# EAGLE design ccard_v1 (EAGLE 5.02)
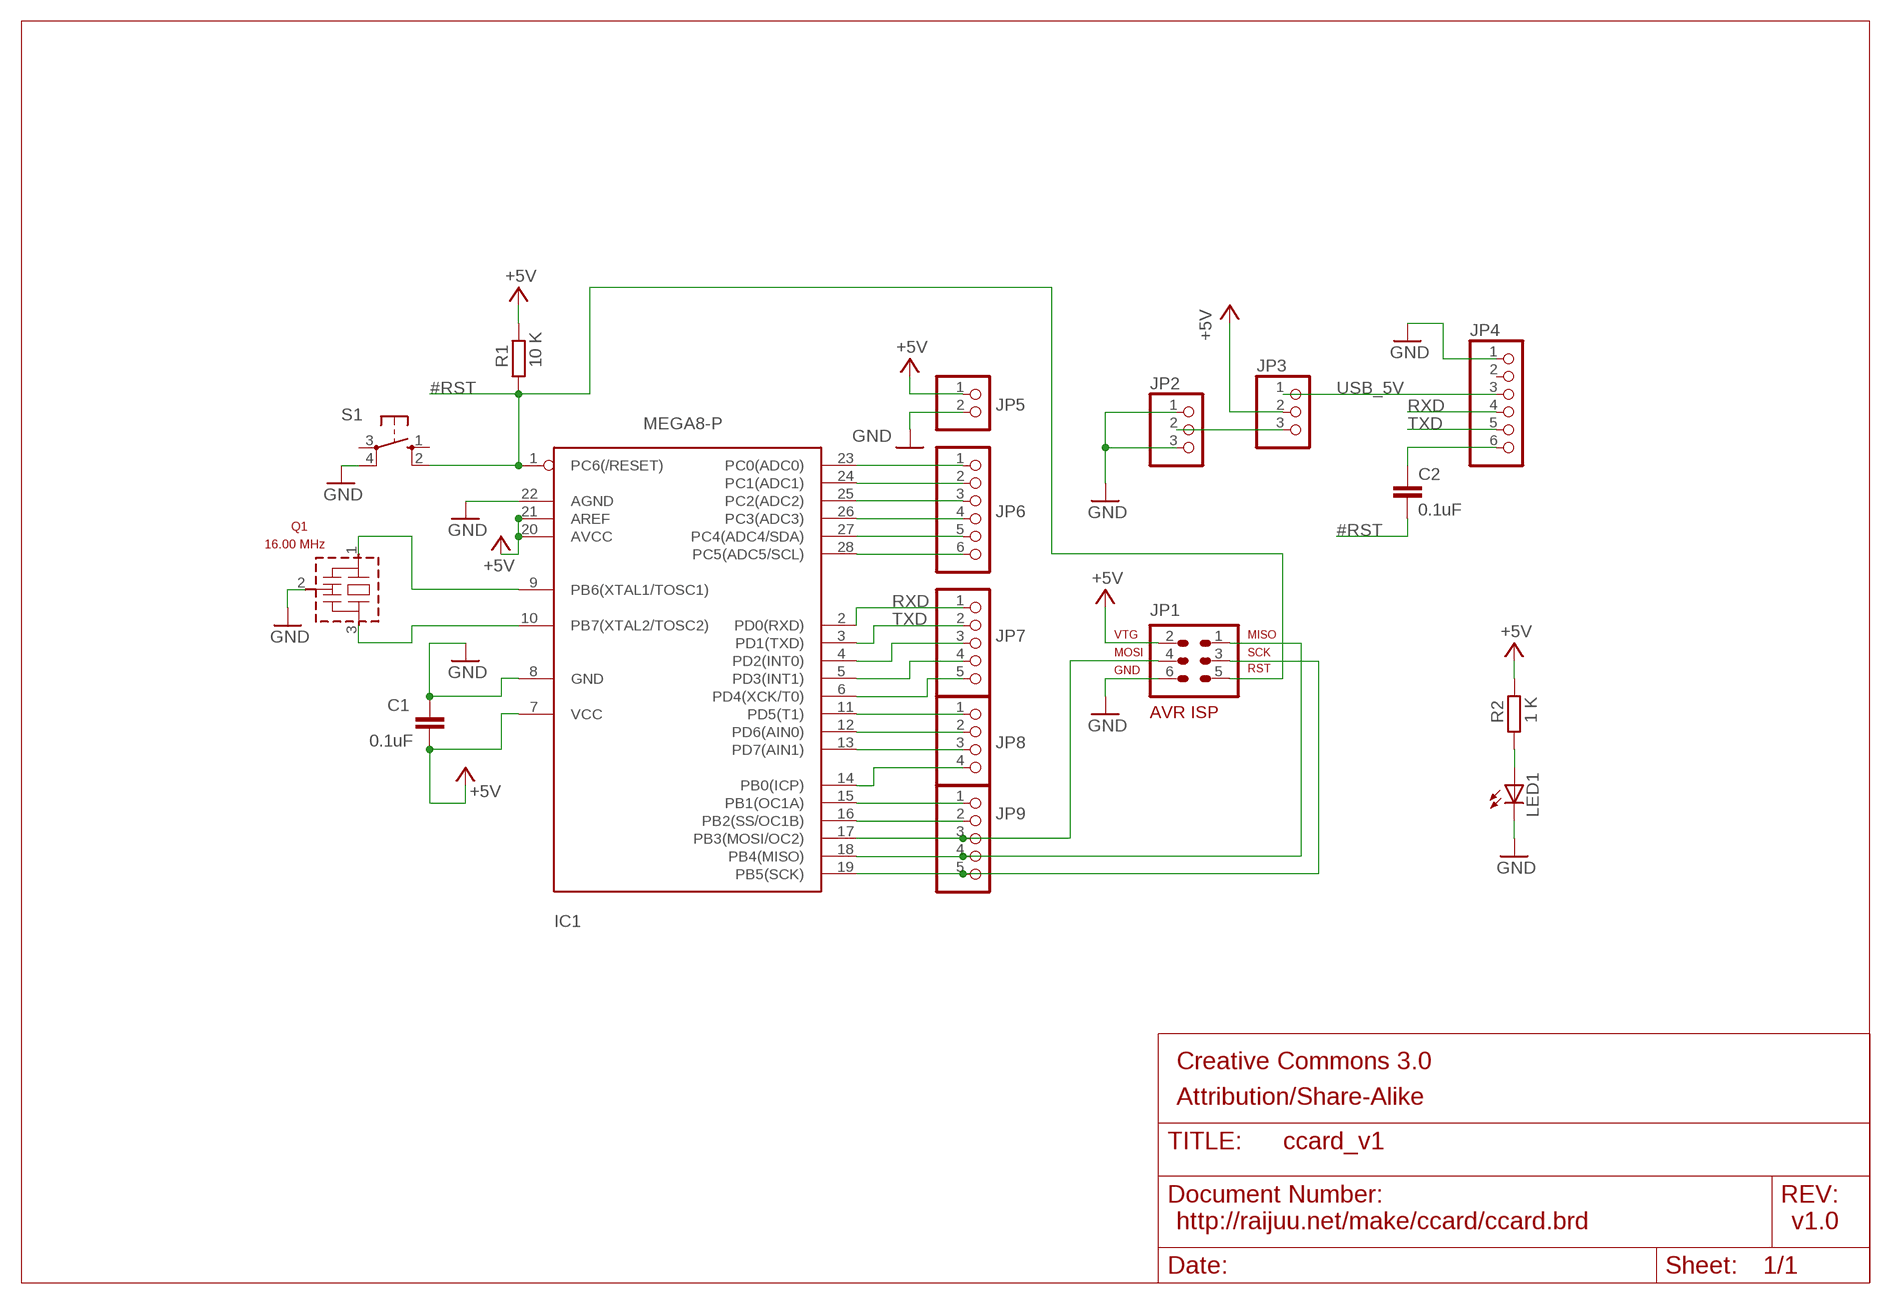
[diagram p0: schematic, sheet 1]

## Parts
C1  0.1uF  C-EU025-025X050  [C025-025X050]
C2  0.1uF  C-EU025-025X050  [C025-025X050]
IC1  MEGA8-P  [DIL28-3]
JP1  AVR-ISP-6  [AVR-ISP-6]
JP2  PINHD-1X390  [1X03/90]
JP3  PINHD-1X3180  [1X03]
JP4  PINHD-1X6  [1X06]
JP5  PINHD-1X2  [1X02]
JP6  PINHD-1X6  [1X06]
JP7  PINHD-1X5  [1X05]
JP8  PINHD-1X4  [1X04]
JP9  PINHD-1X5  [1X05]
LED1  LED3MM  [LED3MM]
Q1  16.00 MHz  CSTLS_G*  [CSTLS_G9]
R1  10 K  R-EU_0207/10  [0207/10]
R2  1 K  R-EU_0207/2V  [0207/2V]
S1  10-XX  [B3F-10XX]

## Nets
#RST: C2.2 IC1.1(PC6(/RESET)) JP1.5(RST) R1.1 S1.2(S1)
+5V: C1.2 IC1.7(VCC) IC1.20(AVCC) IC1.21(AREF) JP1.2(VTG) JP3.2 JP5.1 R1.2 R2.2
GND: C1.1 IC1.8(GND) IC1.22(AGND) JP1.6(GND) JP2.1 JP2.3 JP4.1 JP5.2 LED1.K(C) Q1.2(VSS) S1.4(P1)
N$2: IC1.19(PB5(SCK)) JP1.3(SCK) JP9.5
N$3: IC1.18(PB4(MISO)) JP1.1(MISO) JP9.4
N$4: IC1.17(PB3(MOSI/OC2)) JP1.4(MOSI) JP9.3
N$5: IC1.10(PB7(XTAL2/TOSC2)) Q1.3
N$6: IC1.9(PB6(XTAL1/TOSC1)) Q1.1
N$7: IC1.23(PC0(ADC0)) JP6.1
N$8: IC1.24(PC1(ADC1)) JP6.2
N$9: IC1.25(PC2(ADC2)) JP6.3
N$10: IC1.26(PC3(ADC3)) JP6.4
N$11: IC1.27(PC4(ADC4/SDA)) JP6.5
N$12: IC1.28(PC5(ADC5/SCL)) JP6.6
N$13: IC1.11(PD5(T1)) JP8.1
N$14: IC1.5(PD3(INT1)) JP7.4
N$15: IC1.4(PD2(INT0)) JP7.3
N$16: LED1.A R2.1
N$17: IC1.16(PB2(SS/OC1B)) JP9.2
N$18: IC1.12(PD6(AIN0)) JP8.2
N$19: IC1.6(PD4(XCK/T0)) JP7.5
N$20: IC1.13(PD7(AIN1)) JP8.3
N$21: IC1.14(PB0(ICP)) JP8.4
N$22: IC1.15(PB1(OC1A)) JP9.1
N$25: C2.1 JP4.6
N$26: JP2.2 JP3.3
RXD: IC1.2(PD0(RXD)) JP4.4 JP7.1
TXD: IC1.3(PD1(TXD)) JP4.5 JP7.2
USB_5V: JP3.1 JP4.3
Unconnected: JP4.2 S1.1(S) S1.3(P)

## Notes on the sheet
- Creative Commons 3.0
- Attribution/Share-Alike
- http://raijuu.net/make/ccard/ccard.brd | v1.0

## Library data of the parts
C1 C2 = ccard:C-EU: CAPACITOR, European symbol
IC1 = ccard:MEGA8-P: MICROCONTROLLER 8 Kbytes FLASH 1 kbytes SRAM 512 bytes EEPROM USART 4-channel 10 bit ADC 2-channel 8 bit ADC Source: avr.lbr
JP1 = ccard:AVR-ISP-6: AVR ISP-6 Serial Programming Header
JP2 JP3 = ccard:PINHD-1X3: PIN HEADER
JP4 JP6 = ccard:PINHD-1X6: PIN HEADER
JP5 = ccard:PINHD-1X2: PIN HEADER
JP7 JP9 = ccard:PINHD-1X5: PIN HEADER
JP8 = ccard:PINHD-1X4: PIN HEADER
LED1 = ccard:LED: LED OSRAM: - CHIPLED LG R971, LG N971, LY N971, LG Q971, LY Q971, LO R971, LY R971 LH N974, LH R974 LS Q976, LO Q976, LY Q976 LO Q996 - Hyper CHIPLED LW Q18S LB Q993, LB Q99A, LB R99A - SideLED LS A670, LO A670, LY A670, LG A670, LP A670 LB A673, LV A673, LT A673, LW A673 LH A674 LY A675 LS A676, LA A676, LO A676, LY A676, LW A676 LS A679, LY A679, LG A679 - Hyper Micro SIDELED® LS Y876, LA Y876, LO Y876, LY Y876 LT Y87S - SmartLED LW L88C, LW L88S LB L89C, LB L89S, LG L890 LS L89K, LO L89K, LY L89K LS L896, LA L896, LO L896, LY L896 - TOPLED LS T670, LO T670, LY T670, LG T670, LP T670 LSG T670, LSP T670, LSY T670, LOP T670, LYG T670 LG T671, LOG T671, LSG T671 LB T673, LV T673, LT T673, LW T673 LH T674 LS T676, LA T676, LO T676, LY T676, LB T676, LH T676, LSB T676, LW T676 LB T67C, LV T67C, LT T67C, LS T67K, LO T67K, LY T67K, LW E67C LS E67B, LA E67B, LO E67B, LY E67B, LB E67C, LV E67C, LT E67C LW T67C LS T679, LY T679, LG T679 LS T770, LO T770, LY T770, LG T770, LP T770 LB T773, LV T773, LT T773, LW T773 LH T774 LS E675, LA E675, LY E675, LS T675 LS T776, LA T776, LO T776, LY T776, LB T776 LHGB T686 LT T68C, LB T68C - Hyper Mini TOPLED® LB M676 - Mini TOPLED Santana® LG M470 LS M47K, LO M47K, LY M47K Source: http://www.osram.convergy.de - LUMILED® LXK2-PW12-R00, LXK2-PW12-S00, LXK2-PW14-U00, LXK2-PW14-V00 LXK2-PM12-R00, LXK2-PM12-S00, LXK2-PM14-U00 LXK2-PE12-Q00, LXK2-PE12-R00, LXK2-PE12-S00, LXK2-PE14-T00, LXK2-PE14-U00 LXK2-PB12-K00, LXK2-PB12-L00, LXK2-PB12-M00, LXK2-PB14-N00, LXK2-PB14-P00, LXK2-PB14-Q00 LXK2-PR12-L00, LXK2-PR12-M00, LXK2-PR14-Q00, LXK2-PR14-R00 LXK2-PD12-Q00, LXK2-PD12-R00, LXK2-PD12-S00 LXK2-PH12-R00, LXK2-PH12-S00 LXK2-PL12-P00, LXK2-PL12-Q00, LXK2-PL12-R00 Source: www.luxeon.com
Q1 = ccard:CSTLS_G: Ceramic resonator 2.00 to 10.00 MHz
R1 R2 = ccard:R-EU_: RESISTOR, European symbol
S1 = ccard:10-XX: OMRON SWITCH

## Board
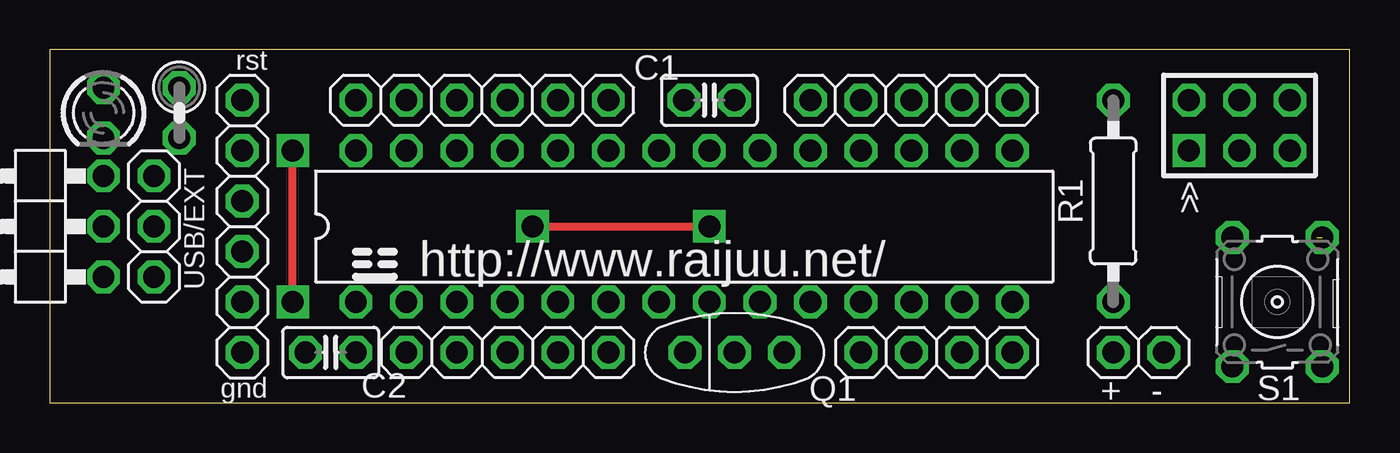
[diagram p1: board, top side]
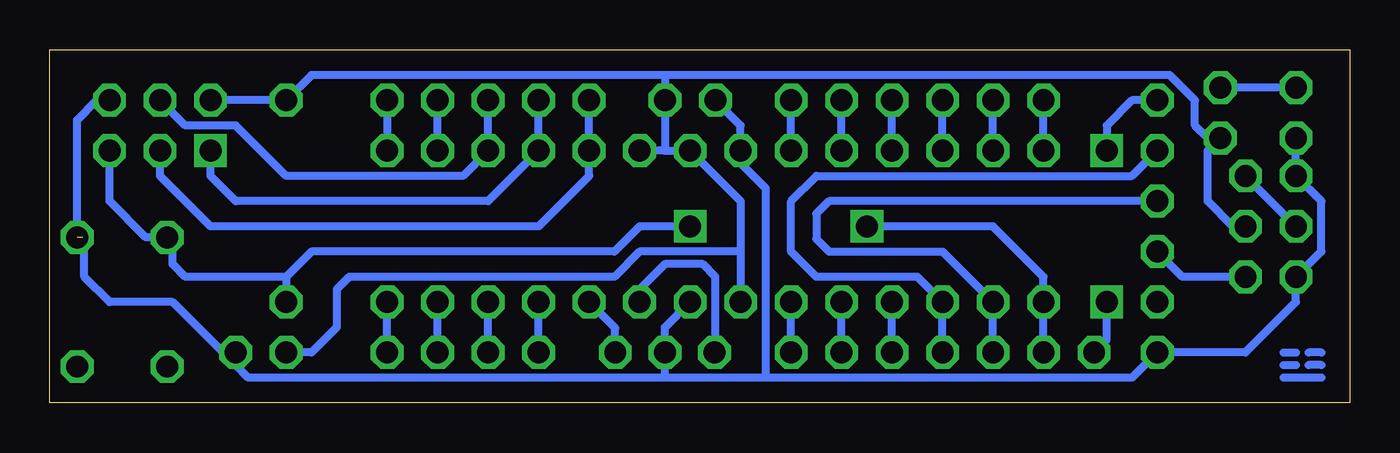
[diagram p2: board, bottom side, seen from below]

Size 65.41 x 17.79 mm. Coordinates in mm from the lower left corner, seen from the top.
Outline: 0,0 65.41,0.01 65.41,17.78 0,17.79 0,0
Copper layers (1*16): Top 0.035mm / dielectric 1.5mm / Bottom 0.035mm
Design rules "default": minimum track width 10mil, minimum drill 24mil, track to track 8mil, track to pad 8mil, pad to pad 8mil, via to via 8mil, smd to smd 8mil, copper to edge 40mil, drill to drill 8mil, minimum pad ring 10mil, minimum via ring 8mil, stop-mask expansion 4mil, vias tented up to drill 0mil, thermal gap 10mil

### Footprints (pad centres in the part's own frame; a part is rotated, then mirrored left to right if it is on the bottom)
C025-025X050 = drill 1.1 octagon: 1 -1.27,0; 2 1.27,0
DIL28-3 = drill 1.1 octagon: 1 -16.51,-3.81; 2 -13.97,-3.81; 3 -11.43,-3.81; 4 -8.89,-3.81; 5 -6.35,-3.81; 6 -3.81,-3.81; 7 -1.27,-3.81; 8 1.27,-3.81; 9 3.81,-3.81; 10 6.35,-3.81; 11 8.89,-3.81; 12 11.43,-3.81; 13 13.97,-3.81; 14 16.51,-3.81; 15 16.51,3.81; 16 13.97,3.81; 17 11.43,3.81; 18 8.89,3.81; 19 6.35,3.81; 20 3.81,3.81; 21 1.27,3.81; 22 -1.27,3.81; 23 -3.81,3.81; 24 -6.35,3.81; 25 -8.89,3.81; 26 -11.43,3.81; 27 -13.97,3.81; 28 -16.51,3.81
AVR-ISP-6 = drill 1.1 square: 1 -2.54,-1.27 | drill 1.1 octagon: 2 -2.54,1.27; 3 0,-1.27; 4 0,1.27; 5 2.54,-1.27; 6 2.54,1.27
1X03/90 = drill 1.1 octagon: 1 -2.54,-3.81; 2 0,-3.81; 3 2.54,-3.81
1X03 = drill 1.1 octagon: 1 -2.54,0; 2 0,0; 3 2.54,0
1X06 = drill 1.1 octagon: 1 -6.35,0; 2 -3.81,0; 3 -1.27,0; 4 1.27,0; 5 3.81,0; 6 6.35,0
1X02 = drill 1.1 octagon: 1 -1.27,0; 2 1.27,0
1X05 = drill 1.1 octagon: 1 -5.08,0; 2 -2.54,0; 3 0,0; 4 2.54,0; 5 5.08,0
1X04 = drill 1.1 octagon: 1 -3.81,0; 2 -1.27,0; 3 1.27,0; 4 3.81,0
LED3MM = drill 1.1 octagon: A -1.27,0; K 1.27,0
CSTLS_G9 = drill 1.1 octagon: 1 -2.5,0; 2 0,0; 3 2.5,0
0207/10 = drill 1.1 octagon: 1 -5.08,0; 2 5.08,0
0207/2V = drill 1.1 octagon: 1 -1.27,0; 2 1.27,0
B3F-10XX = drill 1.1 octagon: 1 -3.251,2.261; 2 3.251,2.261; 3 -3.251,-2.261; 4 3.251,-2.261

### Placement (x,y rotation side)
C1  33.19,15.25 0 top
C2  14.13,2.54 0 top
IC1  31.92,8.9 0 top
JP1  59.86,13.98 0 top
JP2  -1.1,8.9 90 top
JP3  5.24,8.9 90 top
JP4  9.69,8.9 90 top
JP5  54.78,2.54 0 top
JP6  21.75,15.25 180 top
JP7  23.02,2.54 0 top
JP8  44.62,2.54 0 top
JP9  43.35,15.25 180 top
LED1  2.71,14.61 270 top
Q1  34.46,2.54 0 top
R1  53.51,10.17 90 top
R2  6.52,14.61 270 top
S1  61.76,5.08 90 top
U$1  [LOGO-SMALL-COPPER]  1.44,1.27 0 top
U$5  [LOGO-SMALL]  15.41,6.35 0 top

### Tracks (layer width: path | path; a pad name or v marks a point on that pad's centre or on a via)
#RST  (via drill 1.1)
  Top 0.406: v24.29,8.9 v33.19,8.9
  Bottom 0.406: v33.19,8.9 35.73,8.9 37,7.62 52.24,7.62 53.51,6.35 | 53.51,6.35 R1.1 | 53.51,6.35 58.59,6.35 59.22,6.99 59.22,8.26 59.3,8.34 S1.2 60.57,8.34 62.4,10.17 JP1.5 | C2.2 IC1.1 15.41,6.35 17.95,8.9 v24.29,8.9
+5V
  Bottom 0.406: 34.46,12.71 IC1.21 30.64,10.17 30.64,7.62 | 34.46,12.71 IC1.20 | 30.64,7.62 IC1.7 | 34.46,16.52 C1.2 34.46,12.71 | 30.64,7.62 35.73,7.62 37,6.35 50.33,6.35 50.97,5.72 50.97,3.81 52.24,2.54 JP5.1 | 34.46,16.52 52.24,16.52 R1.2 JP1.2 | JP3.2 5.88,8.9 7.15,10.17 7.15,12.71 R2.2 7.15,13.34 7.79,13.98 7.79,15.25 9.05,16.52 34.46,16.52
GND  (1 unrouted)
  Bottom 0.406: C1.1 30.64,13.98 IC1.22 30.64,12.07 29.38,10.8 29.38,1.27 | 34.46,3.81 Q1.2 34.46,1.27 | 34.46,3.81 IC1.8 | 34.46,1.27 34.46,3.81 | 34.46,1.27 55.41,1.27 56.05,1.91 JP5.2 56.68,2.54 59.22,5.08 62.4,5.08 63.66,6.35 63.66,8.26 63.74,8.34 | S1.4 64.02,14.25 63.03,15.25 JP1.6 | 29.38,1.27 34.46,1.27 | LED1.K JP2.3 1.44,10.17 1.44,7.62 JP2.1 2.71,5.08 5.24,2.54 JP4.1 10.96,1.27 29.38,1.27
N$2
  Bottom 0.406: JP9.5 IC1.19 38.27,11.44 40.8,8.9 57.32,8.9 59.86,11.44 JP1.3
N$3
  Bottom 0.406: JP9.4 IC1.18 43.35,10.17 56.05,10.17 57.32,11.44 JP1.1
N$4
  Bottom 0.406: JP9.3 IC1.17 44.62,11.44 53.51,11.44 56.05,13.98 58.59,13.98 JP1.4
N$5
  Bottom 0.406: Q1.3 36.96,3.77 IC1.10
N$6
  Bottom 0.406: IC1.9 35.73,5.72 34.46,6.99 32.55,6.99 31.92,6.35 31.92,2.54 Q1.1
N$7
  Bottom 0.406: IC1.23 JP6.1
N$8
  Bottom 0.406: IC1.24 JP6.2
N$9
  Bottom 0.406: IC1.25 JP6.3
N$10
  Bottom 0.406: IC1.26 JP6.4
N$11
  Bottom 0.406: IC1.27 JP6.5
N$12
  Bottom 0.406: IC1.28 JP6.6
N$13
  Bottom 0.406: JP8.1 IC1.11
N$14
  Bottom 0.406: JP7.4 IC1.5
N$15
  Bottom 0.406: JP7.3 IC1.4
N$16
  Bottom 0.406: LED1.A R2.1
N$17
  Bottom 0.406: IC1.16 JP9.2
N$18
  Bottom 0.406: JP8.2 IC1.12
N$19
  Bottom 0.406: JP7.5 IC1.6
N$20
  Bottom 0.406: JP8.3 IC1.13
N$21
  Bottom 0.406: JP8.4 IC1.14
N$22
  Bottom 0.406: JP9.1 IC1.15
N$25  (via drill 1.1)
  Top 0.406: v12.23,5.08 v12.23,12.71
  Bottom 0.406: C2.1 12.23,3.18 v12.23,5.08 | JP4.6 10.96,15.25 12.23,13.98 v12.23,12.71
N$26
  Bottom 0.406: JP2.2 JP3.3
RXD
  Bottom 0.406: JP4.4 26.2,10.17 26.84,9.53 26.84,8.26 26.2,7.62 20.48,7.62 IC1.2 JP7.1
TXD
  Bottom 0.406: JP4.5 10.96,11.44 26.84,11.44 28.11,10.17 28.11,7.62 26.84,6.35 21.75,6.35 IC1.3 JP7.2
USB_5V
  Bottom 0.406: JP3.1 8.42,6.35 JP4.3

### Text on the board
tNames: rst | > | > | USB/EXT | http://www.raijuu.net/ | gnd | + | -